# Altium schematic sheet 1 - Position2Go_Revision_History.SchDoc: <Project Name>
size A3; ApprovedBy: <Appr.>; Author: <Author>; CompanyName: Infineon Technologies AG; Engineer: <Rel.>; Organization: Infineon Technologies AG; Address1: IFAG PMM RFS MM AE; Address2: Am Campeon 1-12  -  85579 Neubiberg  -  Germany; Address3: 85579 Neubiberg; Address4: Germany; DocumentNumber: 1; Revision: <Rev.>; SheetNumber: 1; SheetTotal: 11; Release: RC00; PageSetup: Record=PageOptions|CenterHorizontal=True|CenterVertical=True|PrintScale=1.01|XCorrection=1.00|YCorrection=1.00|PrintKind=0|BorderSize=5000000|LeftOffset=0|BottomOffset=0|Orientation=2|PaperLength=1000|PaperWidth=1000|Scale=100|PaperSource=7|PrintQuality=-4|MediaType=1|DitherType=10|PaperKind=A3|PrintScaleMode=1; Doc_ConfidentialStatus: <Confidential>; Doc_Preliminary: <Doc_Preliminary>
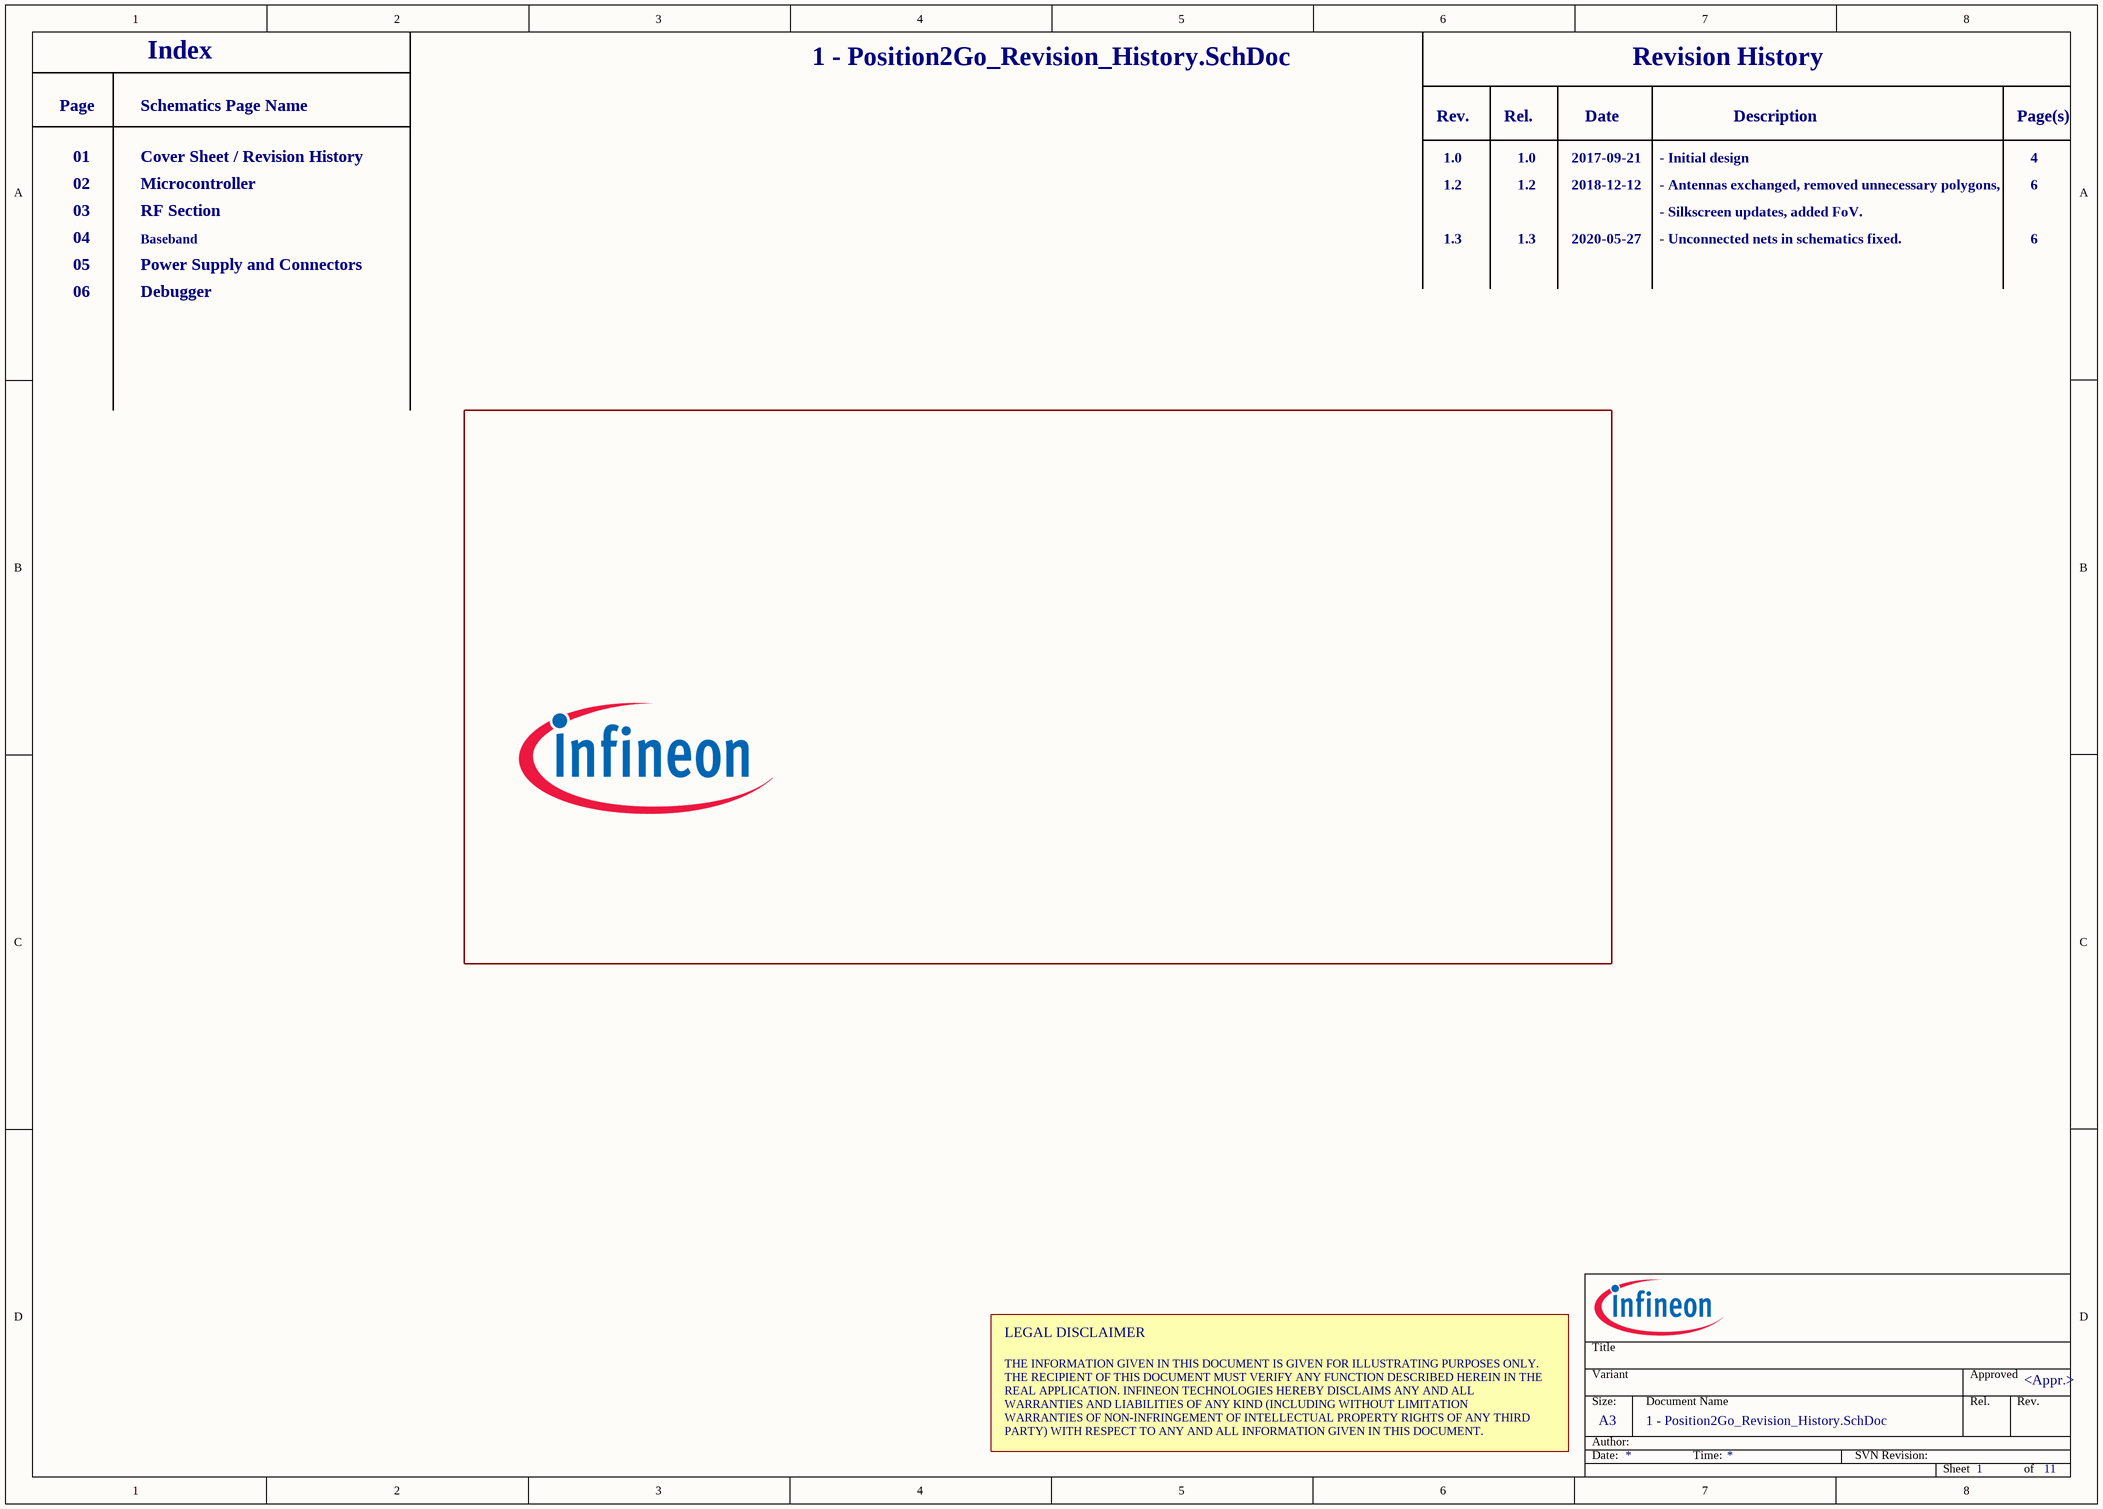
[diagram p0: 1 - Position2Go_Revision_History.SchDoc]

## Notes on the sheet
- Page
- Schematics Page Name
- Index
- Revision History
- 01
- Cover Sheet / Revision History
- Rev.
- 1.0
- Rel.
- 2017-09-21
- Date
- - Initial design
- Description
- Page(s)
- 4
- 03
- 02
- 04
- Microcontroller
- RF Section
- Baseband
- 1.2
- 1.3
- 2018-12-12
- 2020-05-27
- - Antennas exchanged, removed unnecessary polygons,
- - Silkscreen updates, added FoV.
- - Unconnected nets in schematics fixed.
- 6
- 05
- 06
- Power Supply and Connectors
- Debugger
- LEGAL DISCLAIMER
- THE INFORMATION GIVEN IN THIS DOCUMENT IS GIVEN FOR ILLUSTRATING PURPOSES ONLY.
  THE RECIPIENT OF THIS DOCUMENT MUST VERIFY ANY FUNCTION DESCRIBED HEREIN IN THE
  REAL APPLICATION. INFINEON TECHNOLOGIES HEREBY DISCLAIMS ANY AND ALL
  WARRANTIES AND LIABILITIES OF ANY KIND (INCLUDING WITHOUT LIMITATION
  WARRANTIES OF NON-INFRINGEMENT OF INTELLECTUAL PROPERTY RIGHTS OF ANY THIRD
  PARTY) WITH RESPECT TO ANY AND ALL INFORMATION GIVEN IN THIS DOCUMENT.
- Title
- Variant
- Approved
- Date:
- Author:
- Size:
- A3
- Document Name
- Time:
- SVN Revision:
- Sheet
- of